# EAGLE board XMC4500_Relax-V1 (EAGLE 5.07)
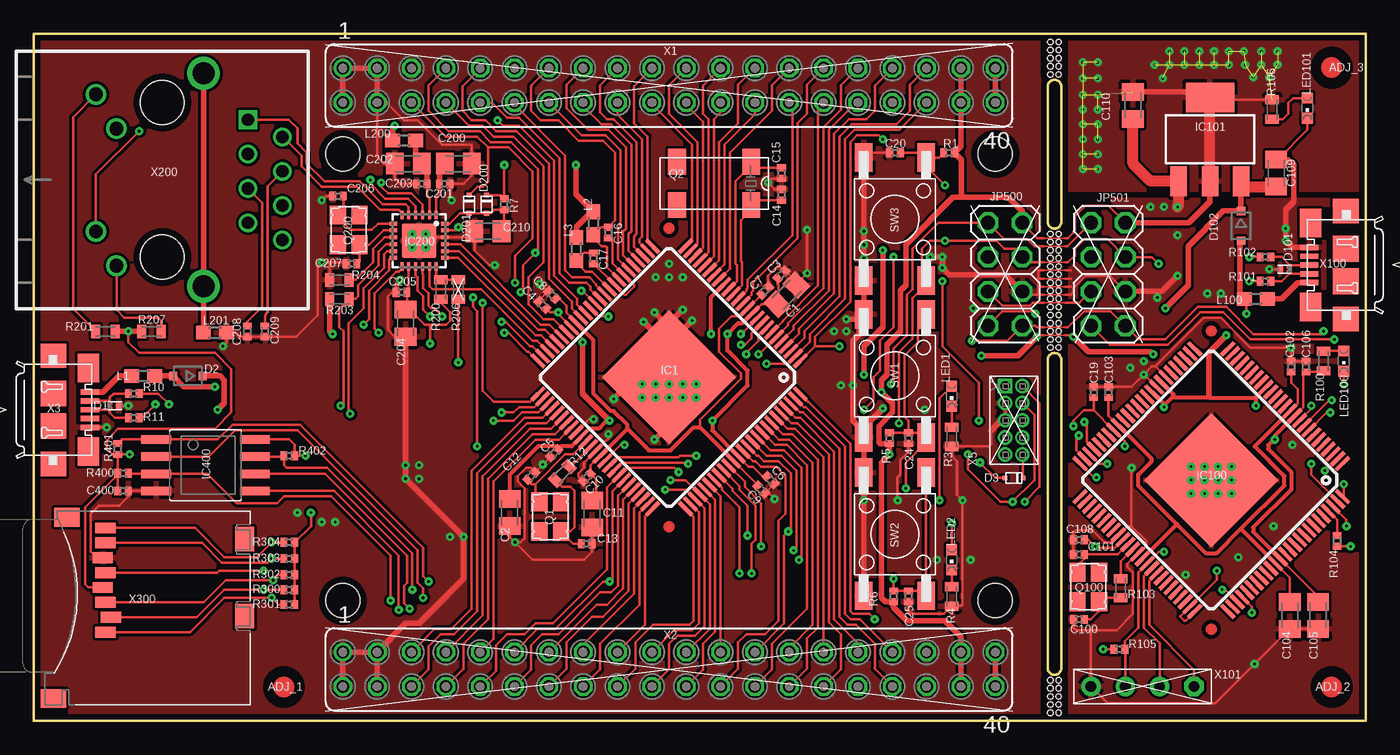
[diagram p2: board, top side]
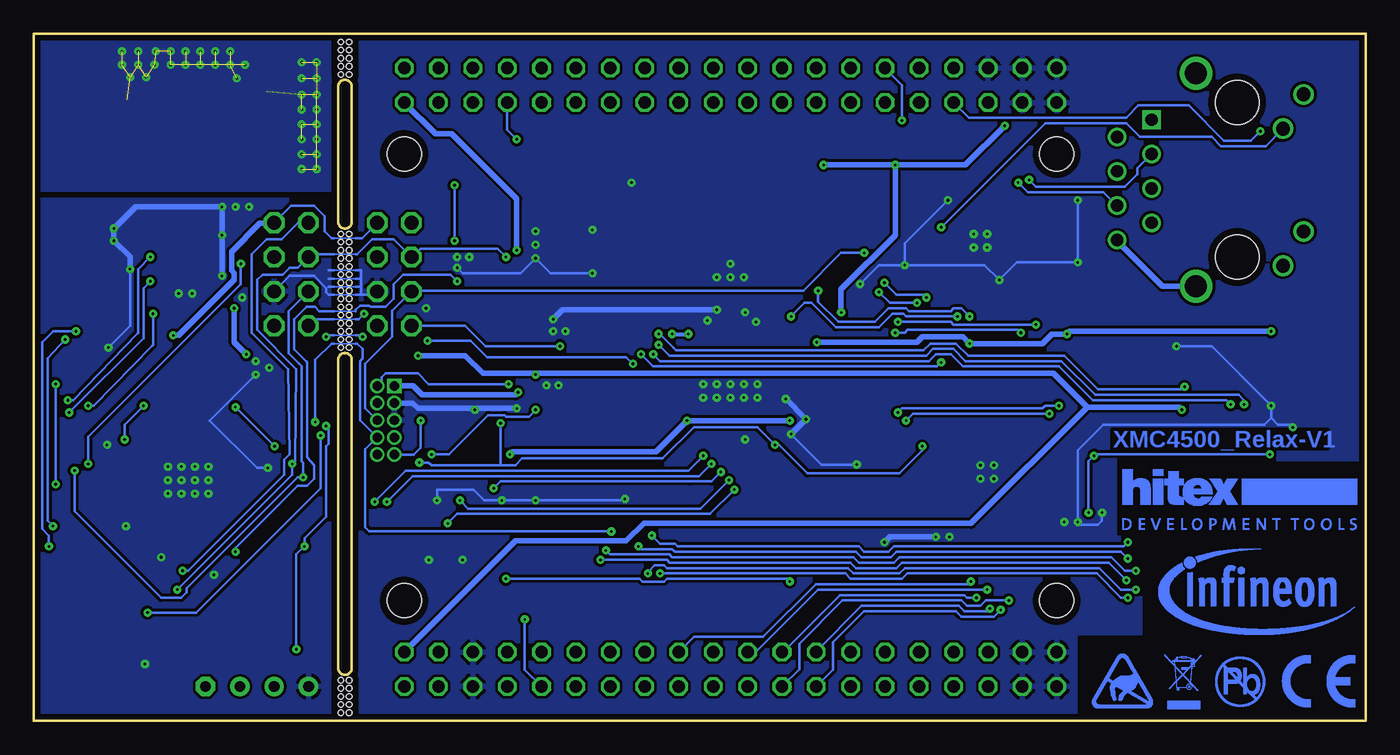
[diagram p3: board, bottom side, seen from below]

Size 98.52 x 50.8 mm. Coordinates in mm from the lower left corner, seen from the top.
Outline: 0,0 98.52,0 98.52,50.8 0,50.8 0,0
Outline: 75,46.9 arc-180 76,46.9 76,36.9 arc-180 75,36.9 75,46.9
Outline: 76,3.9 arc-180 75,3.9 75,26.7 arc-180 76,26.7 76,3.9
Copper layers (1*16): Top 0.035mm / dielectric 1.5mm / Bottom 0.035mm
Design rules "Hitzex_CPU_45A *": minimum track width 0.2mm, minimum drill 0.2mm, track to track 0.2mm, track to pad 0.2mm, pad to pad 0.2mm, via to via 0.2mm, smd to smd 0.2mm, copper to edge 0.5mm, drill to drill 0.5mm, minimum pad ring 7mil, minimum via ring 0.2mm, stop-mask expansion 4mil, vias tented up to drill 0.2mm, thermal gap 10mil
Holes 2.54 mm at 71.12,8.89 22.86,8.89 22.86,41.91 71.12,41.91
Holes 0.4 mm at 75.2,35.4 75.8,35.4 75.2,34.8 75.8,34.8 75.2,34.2 75.8,34.2 75.2,33.6 75.8,33.6 75.2,36 75.8,36 75.2,33 75.8,33 75.2,32.4 75.8,32.4 75.2,31.8 75.8,31.8 75.2,31.2 75.8,31.2 75.2,30.6 75.8,30.6 75.2,30 75.8,30 75.2,29.4 75.8,29.4 75.2,28.8 75.8,28.8 75.2,28.2 75.8,28.2 75.2,27.6 75.8,27.6 75.2,1.2 75.8,1.2 75.2,0.6 75.8,0.6 75.2,49.6 75.8,49.6 75.2,50.2 75.8,50.2 75.2,49 75.2,48.4 75.8,48.4 75.8,49 75.2,1.8 75.2,2.4 75.8,2.4 75.8,1.8 75.2,3 75.8,3 75.2,47.8 75.8,47.8
tRestrict: 4 lines
bRestrict: 6 lines
Milling: 12 lines

## Footprints (pad centres in the part's own frame; a part is rotated, then mirrored left to right if it is on the bottom)
C0805K = smd 1.3 x 1.6: 1 -1,0; 2 1,0
C0402 = smd 0.5 x 0.65: 1 -0.4,0; 2 0.4,0
TSLP-3-1 = smd 0.225 x 0.35: 1 0.113,-0.475; 2 0.487,-0.475 | smd 0.6 x 0.35: 3 0.3,0.175
SOD323-R = smd 0.6 x 0.6: A 1.1,0; C -1.1,0
SC79 = smd 0.35 x 0.35: 1 -0.675,0; 2 0.675,0
P/PG-LQFP-100-11 = smd 1.35 x 0.29: 1 -7.725,6; 2 -7.725,5.5; 3 -7.725,5; 4 -7.725,4.5; 5 -7.725,4; 6 -7.725,3.5; 7 -7.725,3; 8 -7.725,2.5; 9 -7.725,2; 10 -7.725,1.5; 11 -7.725,1; 12 -7.725,0.5; 13 -7.725,0; 14 -7.725,-0.5; 15 -7.725,-1; 16 -7.725,-1.5; 17 -7.725,-2; 18 -7.725,-2.5; 19 -7.725,-3; 20 -7.725,-3.5; 21 -7.725,-4; 22 -7.725,-4.5; 23 -7.725,-5; 24 -7.725,-5.5; 25 -7.725,-6; 51 7.725,-6; 52 7.725,-5.5; 53 7.725,-5; 54 7.725,-4.5; 55 7.725,-4; 56 7.725,-3.5; 57 7.725,-3; 58 7.725,-2.5; 59 7.725,-2; 60 7.725,-1.5; 61 7.725,-1; 62 7.725,-0.5; 63 7.725,0; 64 7.725,0.5; 65 7.725,1; 66 7.725,1.5; 67 7.725,2; 68 7.725,2.5; 69 7.725,3; 70 7.725,3.5; 71 7.725,4; 72 7.725,4.5; 73 7.725,5; 74 7.725,5.5; 75 7.725,6 | smd 0.29 x 1.35: 26 -6,-7.725; 27 -5.5,-7.725; 28 -5,-7.725; 29 -4.5,-7.725; 30 -4,-7.725; 31 -3.5,-7.725; 32 -3,-7.725; 33 -2.5,-7.725; 34 -2,-7.725; 35 -1.5,-7.725; 36 -1,-7.725; 37 -0.5,-7.725; 38 0,-7.725; 39 0.5,-7.725; 40 1,-7.725; 41 1.5,-7.725; 42 2,-7.725; 43 2.5,-7.725; 44 3,-7.725; 45 3.5,-7.725; 46 4,-7.725; 47 4.5,-7.725; 48 5,-7.725; 49 5.5,-7.725; 50 6,-7.725; 76 6,7.725; 77 5.5,7.725; 78 5,7.725; 79 4.5,7.725; 80 4,7.725; 81 3.5,7.725; 82 3,7.725; 83 2.5,7.725; 84 2,7.725; 85 1.5,7.725; 86 1,7.725; 87 0.5,7.725; 88 0,7.725; 89 -0.5,7.725; 90 -1,7.725; 91 -1.5,7.725; 92 -2,7.725; 93 -2.5,7.725; 94 -3,7.725; 95 -3.5,7.725; 96 -4,7.725; 97 -4.5,7.725; 98 -5,7.725; 99 -5.5,7.725; 100 -6,7.725 | smd 7 x 7: EXP 0,0
SOT223 = smd 1.219 x 2.235: 1 -2.311,-3.099; 2 0,-3.099; 3 2.311,-3.099 | smd 3.6 x 2.2: 4 0,3.099
QFN24 = smd 0.6 x 0.3: 1 -1.905,1.27; 2 -1.905,0.762; 3 -1.905,0.254; 4 -1.905,-0.254; 5 -1.905,-0.762; 6 -1.905,-1.27; 13 1.905,-1.27; 14 1.905,-0.762; 15 1.905,-0.254; 16 1.905,0.254; 17 1.905,0.762; 18 1.905,1.27 | smd 0.3 x 0.6: 7 -1.27,-1.905; 8 -0.762,-1.905; 9 -0.254,-1.905; 10 0.254,-1.905; 11 0.762,-1.905; 12 1.27,-1.905; 19 1.27,1.905; 20 0.762,1.905; 21 0.254,1.905; 22 -0.254,1.905; 23 -0.762,1.905; 24 -1.27,1.905 | smd 2.55 x 2.55: EXP 0,0
SO08W = smd 2.2 x 0.635: 1 -3.651,1.905; 2 -3.651,0.635; 3 -3.651,-0.635; 4 -3.651,-1.905; 5 3.651,-1.905; 6 3.651,-0.635; 7 3.651,0.635; 8 3.651,1.905
2X04 = drill 1.016 octagon: 1 -3.81,-1.27; 2 -3.81,1.27; 3 -1.27,-1.27; 4 -1.27,1.27; 5 1.27,-1.27; 6 1.27,1.27; 7 3.81,-1.27; 8 3.81,1.27
L1608 = smd 1.1 x 1: 1 -0.85,0; 2 0.85,0
CHIPLED_0603 = smd 0.8 x 0.8: A 0,-0.75; C 0,0.75
32X25_4PAD = smd 1.4 x 1.2: 1 -1.1,-0.8; 2 1.1,-0.8; 3 1.1,0.8; 4 -1.1,0.8
SMD4_270 = smd 1.3 x 1.9: 1 -2.75,-1.6; 2 2.75,-1.6; 3 2.75,1.6; 4 -2.75,1.6
R0402 = smd 0.5 x 0.65: 1 -0.4,0; 2 0.4,0
R0603 = smd 0.67 x 1: 1 -0.715,0; 2 0.715,0
FSM2JSMA = smd 2.1 x 1.3: P -4.55,-2.3; P1 4.55,-2.3; S -4.55,2.3; S1 4.55,2.3
FE20-2 = drill 0.914 round: 1 -24.13,1.27 | drill 0.914 octagon: 2 -24.13,-1.27; 3 -21.59,1.27; 4 -21.59,-1.27; 5 -19.05,1.27; 6 -19.05,-1.27; 7 -16.51,1.27; 8 -16.51,-1.27; 9 -13.97,1.27; 10 -13.97,-1.27; 11 -11.43,1.27; 12 -11.43,-1.27; 13 -8.89,1.27; 14 -8.89,-1.27; 15 -6.35,1.27; 16 -6.35,-1.27; 17 -3.81,1.27; 18 -3.81,-1.27; 19 -1.27,1.27; 20 -1.27,-1.27; 21 1.27,1.27; 22 1.27,-1.27; 23 3.81,1.27; 24 3.81,-1.27; 25 6.35,1.27; 26 6.35,-1.27; 27 8.89,1.27; 28 8.89,-1.27; 29 11.43,1.27; 30 11.43,-1.27; 31 13.97,1.27; 32 13.97,-1.27; 33 16.51,1.27; 34 16.51,-1.27; 35 19.05,1.27; 36 19.05,-1.27; 37 21.59,1.27; 38 21.59,-1.27; 39 24.13,1.27; 40 24.13,-1.27
ZX62-AB-5PA_MICRO-USB = smd 0.4 x 1.35: 1 -1.3,1.45; 2 -0.65,1.45; 3 0,1.45; 4 0.65,1.45; 5 1.3,1.45 | smd 2.1 x 1.6: S1 -3.1,1.35; S2 3.1,1.35 | smd 1.8 x 1.9: S3 -4,-1.25; S4 4,-1.25 | smd 1.9 x 1.9: S5 -1.2,-1.25; S6 1.2,-1.25
FTSH-105-01-F-D-K = drill 0.7 pad 1.05 square: 1 -2.54,-0.635 | drill 0.7 pad 1.05 round: 2 -2.54,0.635; 3 -1.27,-0.635; 4 -1.27,0.635; 5 0,-0.635; 6 0,0.635; 7 1.27,-0.635; 8 1.27,0.635; 9 2.54,-0.635; 10 2.54,0.635
MA04-1 = drill 0.8 pad 1.422 octagon: 1 -3.81,0 | drill 0.8 pad 1.422 round: 2 -1.27,0; 3 1.27,0; 4 3.81,0
J0-A/B/F = drill 0.914 square: 1 4.445,-6.35 | drill 0.914 round: 2 3.175,-8.89; 3 1.905,-6.35; 4 0.635,-8.89; 5 -0.635,-6.35; 6 -1.905,-8.89; 7 -3.175,-6.35; 8 -4.445,-8.89 | drill 1.016 round: 9 6.325,4.902; 10 3.785,3.378; 11 -3.81,4.902; 12 -6.35,3.378 | drill 1.626 round: S1 -7.874,-3.048; S2 7.874,-3.048 | hole 3.251: -5.715,0; 5.715,0
3M_MICRO-SD_SLOT = smd 0.8 x 1.5: 1 -1.94,2.7; 2 -0.84,2.3; 3 0.26,2.7; 4 1.36,2.9; 5 2.46,2.7; 6 3.56,2.9; 7 4.66,2.7; 8 5.76,2.7 | smd 1.4 x 1.9: S1 -6.85,6.55; S2 6.55,5.55 | smd 1.8 x 1.4: S3 4.95,-7.6; S4 -0.75,-7.6

## Placement (x,y rotation side)
ADJ_1  FIDUCIAL  [FIDUCIAL]  18.5,2.5 0 top
ADJ_2  FIDUCIAL  [FIDUCIAL]  96,2.5 0 top
ADJ_3  FIDUCIAL  [FIDUCIAL]  96,48.3 0 top
C1  10uF/10V  [C0805K]  55.7,31.52 45 top
C2  10uF/10V  [C0805K]  35.2,15.4 270 top
C3  100nF  [C0402]  55.3,33 45 top
C4  100nF  [C0402]  37.62,30.76 135 top
C5  100nF  [C0402]  38.5,19.8 225 top
C6  100nF  [C0402]  54.5,17.8 315 top
C7  100nF  [C0402]  54.1,31.8 45 top
C8  100nF  [C0402]  38.33,31.49 135 top
C9  100nF  [C0402]  53.8,17.1 315 top
C10  100nF  [C0402]  40.9,18 225 top
C11  10uF/10V  [C0805K]  41.3,15.3 270 top
C12  15pF  [C0402]  36.8,18.1 45 top
C13  15pF  [C0402]  40.9,13.1 0 top
C14  15pF  [C0402]  55.3,38.9 90 top
C15  15pF  [C0402]  55.3,40.5 270 top
C16  100nF  [C0402]  42.5,36.1 270 top
C17  100nF  [C0402]  41.4,34.2 270 top
C19  100nF  [C0402]  78.4,24.3 90 top
C20  10nF  [C0402]  63.7,42 180 top
C24  100nF  [C0402]  64.7,20.9 270 top
C25  100nF  [C0402]  64.7,9.2 270 top
C100  15pF  [C0402]  77.3,7.5 180 top
C101  15pF  [C0402]  77.3,12.3 180 top
C102  100nF  [C0402]  93,26.2 90 top
C103  100nF  [C0402]  79.5,24.3 90 top
C104  10uF/10V  [C0805K]  92.9,7.8 270 top
C105  10uF/10V  [C0805K]  95,7.8 270 top
C106  100nF  [C0402]  94.1,26.2 90 top
C108  100nF  [C0402]  77.3,13.4 180 top
C109  10uF/10V  [C0805K]  91.9,40.5 90 top
C110  10uF/10V  [C0805K]  81.3,45.5 270 top
C200  22uF/10V  [C0805K]  31.4,41.2 0 top
C201  100nF  [C0402]  30.4,39.7 0 top
C202  22uF/10V  [C0805K]  27.7,41.2 180 top
C203  100nF  [C0402]  28.7,39.7 180 top
C204  22uF/10V  [C0805K]  27.5,29.4 270 top
C205  100nF  [C0402]  27.2,31.7 180 top
C206  22pF  [C0402]  22.5,38.8 180 top
C207  22pF  [C0402]  23.5,33.8 180 top
C208  100nF  [C0402]  15.8,28.8 270 top
C209  100nF  [C0402]  17.1,28.8 270 top
C210  10uF/10V  [C0805K]  33.6,36.2 180 top
C400  100nF  [C0402]  6.6,17 0 top
D1  ESD8V0L2B-03L  [TSLP-3-1]  6.1,23.6 270 top
D2  BAT60A  [SOD323-R]  11.4,25.5 180 top
D3  BAT54-02V  [SC79]  72.5,17.96 180 top
D101  ESD8V0L2B-03L  [TSLP-3-1]  92.4,33.1 90 top
D102  BAT60A  [SOD323-R]  89.3,36.6 270 top
D200  BAT54-02V  [SC79]  33.5,38.2 270 top
D201  BAT54-02V  [SC79]  32.2,38.2 270 top
DRILEGEND  [DRILEGEND]  -15.14,-18.75 0 top  (outside the outline)
IC1  XMC4500_LQFP100  [P/PG-LQFP-100-11]  46.99,25.39 225 top
IC100  XMC4500_LQFP100  [P/PG-LQFP-100-11]  87.1,17.8 225 top
IC101  IFX1117MEV33  [SOT223]  87,43 0 top
IC200  KSZ8031RNL  [QFN24]  28.5,35.5 270 top
IC400  S25FL032P0XMFI01  [SO08W]  12.7,18.9 0 top
JP500  [2X04]  71.85,33.02 270 top
JP501  [2X04]  79.47,33.02 270 top
L1  BLM18PG600  [L1608]  8.1,25.5 180 top
L2  BLM18PG600  [L1608]  41.4,36.8 90 top
L3  BLM18PG600  [L1608]  40.13,34.89 90 top
L100  BLM18PG600  [L1608]  90.4,31.2 0 top
L200  BLM18PG600  [L1608]  27.4,42.9 0 top
L201  BLM18PG600  [L1608]  13.4,28.7 0 top
LED1  LED-RT/D/0603  [CHIPLED_0603]  67.9,24 180 top
LED2  LED-RT/D/0603  [CHIPLED_0603]  67.9,11.9 180 top
LED100  LED-GN/D/0603  [CHIPLED_0603]  96.9,26.6 180 top
LED101  LED-GN/D/0603  [CHIPLED_0603]  94.2,45.3 180 top
Q1  12MHZ/S/3.2X2.5  [32X25_4PAD]  38.2,15.1 270 top
Q2  32.768KHz  [SMD4_270]  50.33,39.74 180 top
Q100  12MHZ/S/3.2X2.5  [32X25_4PAD]  78,9.9 270 top
Q200  25MHz/50ppm  [32X25_4PAD]  23.3,36.3 270 top
R1  10k/0402  [R0402]  67.7,42 0 top
R3  680R  [R0603]  67.9,21 90 top
R4  680R  [R0603]  67.9,9.2 90 top
R5  10k  [R0402]  63.3,20.9 270 top
R6  10k  [R0402]  63.6,9.2 270 top
R7  10k  [R0402]  34.8,38.2 90 top
R10  33R  [R0402]  7.4,24.2 0 top
R11  33R  [R0402]  7.4,22.4 0 top
R12  510R  [R0603]  39.1,18.3 225 top
R100  680R  [R0603]  95.4,26.6 270 top
R101  33R/0402  [R0402]  91.1,32.5 0 top
R102  33R/0402  [R0402]  91.1,34.3 0 top
R103  510R/0603  [R0603]  80.4,9.8 270 top
R104  100R  [R0402]  96.4,13.3 270 top
R105  10k  [R0402]  80.3,5.3 180 top
R106  680R/0603  [R0603]  91.6,45.2 90 top
R200  1k  [R0603]  30.1,31.9 270 top
R201  120R  [R0603]  5.3,28.8 0 top
R203  1k  [R0603]  22.6,31.2 0 top
R204  6k49  [R0603]  22.6,32.6 0 top
R206  no ass./0R  [R0603]  31.4,31.9 270 top
R207  120R  [R0603]  8.7,28.8 180 top
R300  10k  [R0402]  18.9,9.7 0 top
R301  10k  [R0402]  18.9,8.6 0 top
R302  10k  [R0402]  18.9,10.8 0 top
R303  10k  [R0402]  18.9,12 0 top
R304  10k  [R0402]  18.9,13.2 0 top
R400  10k  [R0402]  6.6,18.3 180 top
R401  10k  [R0402]  6.2,20.1 270 top
R402  10k  [R0402]  18.9,19.6 0 top
SW1  TMPS2-SMD  [FSM2JSMA]  63.7,25.5 90 top
SW2  TMPS2-SMD  [FSM2JSMA]  63.7,13.8 90 top
SW3  TMPS2-SMD  [FSM2JSMA]  63.7,37.1 90 top
U$12  [INFINEON_ICON_3-SILK]  90.8,1.15 0 top
U$13  [INFINEON_LOGO_5-SILK]  21.59,17.78 0 top
U$71  [DIN_A5_L]  -50.8,-63.5 0 top  (outside the outline)
X1  2x20  [FE20-2]  46.99,46.99 0 top
X2  2*20  [FE20-2]  46.99,3.81 0 top
X3  ZX62-AB-5PA  [ZX62-AB-5PA_MICRO-USB]  2.7,23 270 top
X5  FTSH-105-01-F-D-K  [FTSH-105-01-F-D-K]  72.48,22.23 270 top
X100  ZX62-AB-5PA  [ZX62-AB-5PA_MICRO-USB]  95.8,33.7 90 top
X101  no ass.  [MA04-1]  82.01,2.54 180 top
X200  Würth 7499010211A  [J0-A/B/F]  9.5,40 90 top
X300  3M_2908-05WB  [3M_MICRO-SD_SLOT]  8,8.5 90 top

## Tracks (layer width: path | path; a pad name or v marks a point on that pad's centre or on a via)
AGND
  Top 0.2: C16.2 42.8,35.4 42.8,33.83 IC1.32 44.4,32.23 44.4,32.1 43.8,31.5 43.71,31.5 IC1.34 41.41,33.8 C17.2
CS  (via drill 0.2)
  Top 0.2: IC100.79 90.1,8.44 v90.1,8 | IC100.49 77.1,20.02 77.1,20.9 v77.3,21.1
  Bottom 0.2: v90.1,8 86.5,8 77.3,17.2 v77.3,21.1
DBGPRES#  (via drill 0.2)
  Top 0.2: X101.3 80.74,5.26 R105.1 80.7,5.9 81.7,6.9 81.7,10.99 IC100.65 83.21,12.5 v83.6,12.5 | v67.2,32.5 67.2,27.7 69.9,25 v69.9,22.2
  Bottom 0.102: 76.3,30.3 74.7,30.3
  Bottom 0.2: v83.6,12.5 83.6,12.8 79,17.4 78.3,17.4 77.8,17.9 77.8,18.9 78.3,19.5 78.3,26.5 78.39,26.6 79.27,27.48 79.27,29.68 78.35,30.6 77.7,30.6 77.4,30.3 76.3,30.3 | v67.2,32.5 67.7,33 71.2,33 71.9,32.3 71.9,31.2 72.5,30.6 73.6,30.6 73.7,30.7 74.4,30.7 74.7,30.4 74.7,30.3 | X5.9 70.42,19.68 69.9,20.2 v69.9,22.2
DEBUG_LED  (via drill 0.2)
  Top 0.2: IC100.100 96.9,16.68 v96.9,17.5 | v96.9,24.9 LED100.C
  Bottom 0.2: v96.9,17.5 v96.9,24.9
ETH_CLK  (via drill 0.2)
  Top 0.2: IC200.16 28.75,33.05 28.8,33 28.8,32 29.2,31.6 29.2,30.7 29.4,30.5 29.6,30.5 v30.2,29.9 | IC1.39 41.78,29.9 v42.5,29.9
  Bottom 0.2: v42.5,29.9 41.5,30.9 41,30.9 39.2,29.1 36,29.1 35,30.1 34.2,30.1 34,29.9 v30.2,29.9
ETH_CRS  (via drill 0.2)
  Top 0.2: IC200.15 28.25,32.95 28.4,32.8 28.4,31.8 28.8,31.4 28.8,30.4 v29.3,29.9 | IC1.38 40.59,31.8 v40.5,31.8
  Bottom 0.2: v40.5,31.8 40.5,31 39,29.5 36.3,29.5 35.3,30.5 34,30.5 33.8,30.3 30.7,30.3 30.5,30.5 29.9,30.5 v29.3,29.9
ETH_MDC  (via drill 0.2)
  Top 0.2: IC200.11 26.14,34.74 25.9,34.5 25.9,33.5 24.4,32 24.4,30.5 23.3,29.4 23.3,22.8 v23.4,22.7 | IC1.53 37.33,22.8 36.1,22.8 35.5,22.2 v34,22.2
  Bottom 0.2: v23.4,22.7 33.5,22.7 v34,22.2
ETH_MDIO  (via drill 0.2)
  Top 0.2: IC200.10 26.05,35.25 25.5,34.7 25.5,33.7 24,32.2 24,31.4 23.8,31.2 R203.2 22.6,30.48 22.6,29.1 22.9,28.8 22.9,23.5 v22.7,23.3 | IC1.52 37.02,23.2 35.9,23.2 35.5,22.8 v34.6,22.8
  Bottom 0.2: v22.7,23.3 23.7,23.3 23.9,23.1 34.3,23.1 v34.6,22.8
ETH_RXD0  (via drill 0.2)
  Top 0.2: IC1.50 36.6,27.3 36.5,27.3 35.1,28.7 v34.8,28.7 | IC200.13 27.23,33.43 27,33.2 26.8,33.2 25.2,31.6 25.2,29 v25.5,28.7
  Bottom 0.2: v25.5,28.7 25.7,28.9 33.9,28.9 34.1,28.7 v34.8,28.7
ETH_RXD1  (via drill 0.2)
  Top 0.2: IC1.49 36.91,27.7 36.7,27.7 34.9,29.5 v34.6,29.5 | IC200.12 26.43,34.23 26.3,34.1 26.3,33.3 24.8,31.8 24.8,29.7 v24.4,29.3
  Bottom 0.2: v24.4,29.3 30.5,29.3 30.7,29.5 v34.6,29.5
ETH_RXER
  Top 0.2: IC1.48 37.22,28.1 36.9,28.1 33.1,31.9 29.5,31.9 29.26,32.14 IC200.17
ETH_TXD0
  Top 0.2: IC1.46 37.83,28.9 37.3,28.9 31.46,34.74 IC200.20
ETH_TXD1
  Top 0.2: IC1.45 38.14,29.3 37.5,29.3 31.55,35.25 IC200.21
ETH_TXEN
  Top 0.2: IC1.47 37.52,28.5 37.1,28.5 31.37,34.23 IC200.19
GND  (via drill 0.2)
  Top 0.102: 74.7,31.5 76.3,31.5 | 74.7,32.1 76.3,32.1 | 74.7,32.7 76.3,32.7 | 74.7,33.3 76.3,33.3
  Top 0.2: v7,23.3 D1.3 | C105.2 C104.2 87.4,1.3 79.44,1.3 X101.4 78.2,6.7 | C106.2 C102.2 v93,27.6 90,27.6 87.8,29.8 86.54,29.8 82.94,26.2 | C19.2 C103.2 81.2,24.7 v82.1,25.6 | 78.2,6.7 80.1,6.7 81.3,7.9 81.3,11 80.9,11.4 80.9,11.6 IC100.63 82.3,13 82.3,13.3 81.2,14.4 | C100.2 76.9,6.9 77.1,6.7 78.2,6.7 | C101.2 C108.2 76.9,13.9 77.1,14.1 78.3,14.1 79.2,13.2 79.67,13.2 IC100.59 80.87,14.4 81.2,14.4 | v91.4,33.4 D101.3 | 56.41,32.46 C1.2 | 56.41,32.46 C3.2 55.52,33.28 55.1,33.7 54.3,32.9 54.3,32.17 C7.2 | C4.2 37.34,31.07 C8.2 37.52,32.3 v37.4,32.3 | C6.2 C9.2 54.38,16.82 v54.8,16.4 | C10.2 40.3,18.03 40.3,18.3 40.7,18.7 40.7,19.1 IC1.63 42.5,20.9 v42.5,21.2 | C5.2 v37.65,18.95 C12.2 36.77,18.7 36.4,18.7 35.8,18.1 35.8,17.7 36.3,17.2 36.3,13.5 36,13.2 v35.6,13.2 | C204.2 26.7,28.4 26.2,28.9 26.2,31.4 26.5,31.7 C205.2 26.8,32.3 v27.1,32.6 | C203.2 27.1,39.7 26.7,40.1 C202.2 25.9,41.2 25.4,41.7 X1.4 26.08,45.72 27.4,44.4 28.4,44.4 30.2,42.6 32.4,42.6 C200.2 32.4,40.3 31.8,39.7 C201.2 30.8,38.6 v30.9,38.5 | C25.2 64.7,8.1 64.9,7.9 67.31,7.9 R4.1 67.92,8.5 68.6,8.5 68.7,8.6 v68.7,16.3 68.3,16.7 68.3,19.2 67.9,19.6 R3.1 67.92,20.3 70.7,20.3 70.8,20.4 70.8,21.46 | C20.2 61.75,42 SW3.S1 | 41.2,14.3 C11.2 C13.2 41.3,12.5 40.7,11.9 36.9,11.9 v35.6,13.2 | C109.2 92,41.5 94.2,43.7 LED101.C | 82.94,26.2 IC100.32 | 82.94,26.2 82.7,26.2 v82.1,25.6 | IC100.34 82.13,25.6 v82.1,25.6 | v81.2,18.7 81.2,14.4 | C206.2 21.6,38.8 v21.3,38.5 | 21.89,33.9 23,33.9 C207.2 | 21.89,33.9 R204.1 | 21.89,33.9 v21.3,33.9 21,33.6 21,30 19.4,28.4 C209.2 C208.2 15.2,28.4 14.9,28.7 L201.2 14.25,27.95 v14,27.7
  Top 0.2: IC200.EXP 28.75,35.75 IC200.22 32.15,35.75 C210.2 32.6,34.8 33.7,33.7 v34.1,33.7 | 56.41,32.46 56.56,32.46 v57.2,33.1 v57.2,36.3 | C400.2 IC400.4 | C400.2 7,16.6 6.3,15.9 4.8,15.9 4.2,15.3 4.2,12.5 4.64,12.06 X300.6 | X3.5 v5.4,21.7 | C400.2 7,16.59 | C2.2 35.2,13.6 v35.6,13.2 | IC1.59 41.07,22.3 v41.4,22.3 | IC1.EXP 46.99,28.5 | 46.99,28.5 46.99,28.8 | 46.99,28.8 46.99,29.39 46.71,29.39 | 61.05,29.7 SW1.S1 | 46.99,28.8 45.8,28.8 | 46.99,28.5 47.6,28.5 | C24.2 64.7,19.9 64.1,19.3 64.1,18.2 63.9,18 v63.9,16.3 | C15.2 54.6,40.1 v54.3,39.8 54.8,39.3 C14.2 | 71.56,22.23 X5.5 X5.3 | JP500.6 73.37,31.5 74.3,31.5 | 74.3,31.5 74.7,31.5 | 76.3,31.5 76.7,31.5 76.9,31.7 76.9,32 77.8,32.9 79.59,32.9 JP501.6 | 74.3,32.1 74.7,32.1 | 74.3,31.5 74.3,32.1 | 74.3,32.7 74.7,32.7 | 74.3,32.1 74.3,32.7 | 74.7,33.3 74.3,33.3 74.3,32.7 | 76.3,32.1 76.7,32.1 | 76.3,32.7 76.7,32.7 | 76.3,33.3 76.7,33.3
  Top 0.4: X100.5 93.1,35 v92.6,35.5 v92.6,36.4 92.6,37.8 93.2,38.4 93.2,41.1 92.8,41.5 C109.2 | X2.2 X2.1 X2.3 | X2.3 X2.4 | X1.2 X1.1 X1.3 X1.4 | SW1.S1 SW3.S v61.4,34.2 SW3.S1 | SW2.S v61.4,16.3 SW2.S1 SW1.S | v84.6,32.9 83.45,31.75 JP501.6 | X2.3 27.52,7.2 28.5,7.2 31.8,10.5 v31.8,13.6 v27.5,17.9 C204.2 | 46.99,29.39 v48,30.4 | v60.1,29.7 61.05,29.7 61.05,28.55 60.6,28.1 60.6,22.2 61.05,21.75 61.05,21.3 SW1.S | 46.71,29.39 v45.9,30.2 | 45.8,28.8 v45.1,29.5 | 47.6,28.5 v48.7,29.6 | IC1.EXP 44.49,25.39 v42.9,23.8 | 70.8,21.46 71.56,22.23 | v62.8,23.1 61.4,21.7 SW1.S | JP500.6 71.87,33 67.7,33 v67.2,33.5 v67.2,34.3 v66.3,34.3 | v45.9,20.8 47.49,22.39
  Top 0.8: C110.2 81.3,41.2 82.6,39.9 IC101.1 84.69,38.09 v84.6,38
  Bottom 0.102: 74.7,31.5 76.3,31.5 | 74.7,32.1 76.3,32.1 | 74.7,32.7 76.3,32.7 | 74.7,33.3 76.3,33.3
  Bottom 0.2: v93,27.6 91.4,29.2 v91.4,33.4 | v82.1,25.6 85.5,22.2 82,18.7 v81.2,18.7 | v21.3,38.5 v21.3,33.9 25.8,33.9 v27.1,32.6 28.2,33.7 v34.1,33.7 | v34.1,33.7 36,33.7 v37.4,32.3 | v30.9,38.5 34.1,35.3 v34.1,33.7 | v57.2,33.1 60.3,33.1 v61.4,34.2 62.5,33.1 66.8,33.1 v67.2,33.5 | 7,22.4 v7,23.3 11.4,27.7 v14,27.7 | v37.65,18.95 40.25,18.95 v42.5,21.2 | v54.8,16.4 54.9,16.3 v61.4,16.3 v63.9,16.3 | v63.9,16.3 65.2,16.3 66,17.1 68.7,17.1 v68.7,16.3 | v63.9,16.3 64,16.4 | v19.5,15.4 19.5,14.8 19.8,14.5 21.1,14.5 v21.3,14.7 21.3,20 19.4,21.9 7.5,21.9 7,22.4 | 7,22.4 6.5,21.9 5.6,21.9 v5.4,21.7 | JP501.6 79.59,32.9 77.8,32.9 76.9,32 76.9,31.7 76.7,31.5 76.3,31.5 | JP500.6 73.37,31.5 74.3,31.5 | 74.3,31.5 74.7,31.5 | 74.3,31.5 74.3,32.1 | 74.3,32.1 74.3,32.7 | 74.3,32.7 74.3,33.3 74.7,33.3 | 74.3,32.1 74.7,32.1 | 74.3,32.7 74.7,32.7 | 76.3,33.3 76.7,33.3 | 76.3,32.7 76.7,32.7 | 76.3,32.1 76.7,32.1
  Bottom 0.4: v91.4,33.4 91.4,34.3 v92.6,35.5 v92.6,36.4 91,38 v84.6,38 v84.6,32.9 | v35.6,13.2 35.2,13.6 v31.8,13.6 | v42.5,21.2 v41.4,22.3 v42.9,23.8 | v48,30.4 59.4,30.4 v60.1,29.7 | X5.3 71.31,23.5 | v62.8,23.1 70.1,23.1 70.5,23.5 71.9,23.5
  other vias: 91.7,14.4 93.1,20.4 89.1,12.1 85.2,10.8 83.6,38 82.6,38 86.6,17.8 87.6,17.8 86.6,18.8 87.6,18.8 87.6,16.8 86.6,16.8 85.6,18.8 85.6,17.8 85.6,16.8 88.6,16.8 88.6,17.8 88.6,18.8 82.1,26.6 81.1,26.1 87.8,31.6 86.8,31.6 90.3,4.2 47,24.9 46,24.9 48,24.9 49,24.9 45,24.9 45,23.9 46,23.9 47,23.9 48,23.9 49,23.9 28,36 28,35 29,35 29,36 84.6,35.9 83.1,31.3 61.4,35.2 61.4,36.2 60.1,28.8 59.2,28.8 60.6,24.8 59.7,24.8 46,32.8 47,32.8 48,32.8 47,33.8 30.8,13.6 28.5,17.9 28.5,18.9 27.5,18.9 22.3,14.7 65.9,23 69.3,11.9 66.8,11.9 69.5,30.5
  pour Top: 76.5,38.5 98.7,38.5 98.7,-0.2 76.5,-0.2
  pour Bottom: 76.5,38.5 98.7,38.5 98.7,-0.2 76.5,-0.2
  pour Bottom: -0.2,51 -0.2,-0.2 74.5,-0.2 74.5,51
  pour Top: -0.2,51 -0.2,-0.2 74.5,-0.2 74.5,51
HIB_IO_0
  Top 0.2: 52.8,32.6 52.8,32.61 | X1.28 56.1,45.44 56.1,35.9 52.8,32.6 | IC1.14 52.7,31.8 52.7,31.9 52.8,32 52.8,32.6
HIB_IO_1
  Top 0.2: IC1.13 53.1,31.5 53.1,31.7 53.2,31.8 53.2,32.4 56.5,35.7 56.5,44.2 57.2,44.9 57.2,47.04 X1.29
MMC_CLK  (via drill 0.2)
  Top 0.2: X300.5 13.56,10.96 13.7,11.1 v17,11.1 | IC1.90 54.2,19.6 55.3,19.6 56.4,18.5 56.4,12.8 v56.2,12.6
  Bottom 0.2: v56.2,12.6 55.9,12.3 51.5,12.3 51.3,12.1 37.9,12.1 37.5,11.7 34.9,11.7 34.5,12.1 18.8,12.1 17.8,11.1 v17,11.1
MMC_CMD  (via drill 0.2)
  Top 0.2: X300.3 12.56,8.76 14.2,10.4 v17.7,10.4 18.1,10.8 R302.1 | IC1.91 54.51,20 55.5,20 56.8,18.7 56.8,12.1 v56.6,11.9
  Bottom 0.2: v17.7,10.4 19,11.7 34.3,11.7 34.7,11.3 37.7,11.3 38.1,11.7 51.5,11.7 51.7,11.9 v56.6,11.9
MMC_DAT0  (via drill 0.2)
  Top 0.2: X300.7 12.44,13.16 13.9,11.7 17.3,11.7 v17.6,12 R303.1 | IC1.85 52.6,17.66 52.6,17.3 53.8,16.1 v53.8,12.9
  Bottom 0.2: v53.8,12.9 53.6,12.7 51.3,12.7 51.1,12.5 37.7,12.5 37.3,12.1 35.1,12.1 34.7,12.5 18.1,12.5 v17.6,12
MMC_DAT1  (via drill 0.2)
  Top 0.2: X300.8 11.94,14.26 14.1,12.1 16.5,12.1 v17.6,13.2 R304.1 | IC1.83 51.7,17.15 51.7,17 52.8,15.9 v52.8,13.7
  Bottom 0.2: v52.8,13.7 52.2,13.1 51.1,13.1 50.9,12.9 37.5,12.9 37.1,12.5 35.3,12.5 34.9,12.9 17.9,12.9 v17.6,13.2
MMC_DAT2  (via drill 0.2)
  Top 0.2: X300.1 11.56,6.56 14.1,9.1 v17.6,9.1 18.1,8.6 R301.1 | IC1.82 50.9,17.24 50.9,17.1 51.9,16.1 52.2,15.8 v52.2,10.9
  Bottom 0.2: v17.6,9.1 18.1,9.1 19.9,10.9 33.9,10.9 34.3,10.5 38.1,10.5 38.5,10.9 v52.2,10.9
MMC_DAT3  (via drill 0.2)
  Top 0.2: X300.2 12.06,7.66 14.1,9.7 v17,9.7 R300.1 | v53.1,10.9 53.1,13.1 53.4,13.4 53.4,15.9 52.2,17.1 52.2,17.36 IC1.84
  Bottom 0.2: v17,9.7 18.1,9.7 19.7,11.3 34.1,11.3 34.5,10.9 37.9,10.9 38.3,11.3 51.7,11.3 51.9,11.5 52.6,11.5 53.1,11 v53.1,10.9
N$1
  Top 0.4: X100.1 93.5,32.4 92.3,31.2 L100.2
N$2
  Top 0.2: R207.1 9.41,29.59 9.2,29.8 6.7,29.8 6.12,30.38 X200.12
N$3
  Top 0.2: R100.1 95.44,27.35 LED100.A
N$4
  Top 0.2: R3.2 LED1.C
N$5
  Top 0.2: R4.2 LED2.C
N$6
  Top 0.2: IC1.62 39.7,18.8 R12.1
N$7
  Top 0.2: R12.2 39.09,17.3 39.7,17.3 40,17 40,14.3 39.7,14 Q1.3 | Q1.3 38.7,13.7 | C13.1 39.9,13.1 Q1.3
N$8
  Top 0.2: IC1.61 39.89,19.7 39.3,19.7 37.1,17.5 | C12.1 36.83,17.5 37.1,17.5 | Q1.1 37.1,16.4 37.1,17.5
N$11
  Top 0.4: X3.1 5.1,24.3 6.3,25.5 L1.2
N$13
  Top 0.2: X3.2 5.46,23.65 D1.1 5.62,23.93 5.9,24.2 R10.1
N$15
  Top 0.2: IC200.5 27.74,37.96 27.5,38.2 25.8,38.2 24.1,39.9 21.5,39.9 20.2,41.2 20.2,42 19.5,42.7 19.5,43.8 18.86,44.45 X200.1
N$16
  Top 0.2: R106.1 92.39,44.48 92.8,44.9 92.8,45.7 93.15,46.05 LED101.A
N$17
  Top 0.2: X200.9 2.9,44.63 2.9,30.48 R201.1
N$18  (via drill 0.2)
  Top 0.2: IC200.23 31.16,36.26 v31.4,36.5
  Bottom 0.2: v31.4,36.5 23.7,44.2 17.7,44.2 16.7,43.2 11.4,43.2 10.7,42.5 7.41,42.5 X200.10
N$19
  Top 0.2: L201.1
  Top 0.4: L201.1 X200.S1 X200.S2
  Bottom 0.4: X200.S1 15.03,32.13 18.39,35.49 X200.8
N$21
  Top 0.2: C210.1 34.8,36.2 R7.1 34.1,37.8 33.83,37.52 D200.2 D201.2 31.52,37.52 30.77,36.77 IC200.24
N$23  (via drill 0.2)
  Top 0.2: IC1.10 52.52,28.8 v52.3,28.6
  Top 0.4: L1.1 D2.A 11.1,24.7 v13.4,24.7
  Bottom 0.2: v13.4,24.7 13.6,24.5 19.8,24.5 22.3,27 29.4,27 30.3,27.9 32.2,27.9 32.7,27.4 51,27.4 51.2,27.6 52.2,28.6 v52.3,28.6
N$26
  Top 0.2: X5.10 73.17,19.63 D3.1
N$36
  Top 0.2: X3.3 5.51,23 D1.2 5.62,22.77 6,22.4 R11.1
N$40
  Top 0.2: X100.2 93.04,33.05 D101.1 92.88,33.08 92.3,32.5 R101.2
N$41
  Top 0.2: X100.3 92.99,33.7 D101.2 92.88,33.73 92.3,34.3 R102.2
N$43
  Top 0.2: C100.1 78.2,7.5 78.8,8.1 Q100.3 79.08,9.09 R103.2
N$47  (via drill 0.2)
  Top 0.2: IC100.10 94.5,23.08 v94.5,23.3 | v89.7,30.1 89.7,31.05 L100.1
  Top 0.4: D102.A 89.2,35.4 89.2,31.55 L100.1
  Bottom 0.2: v94.5,23.3 94.1,23.3 89.75,27.75 89.7,27.8 v89.7,30.1
N$50
  Top 0.2: IC200.6 27.23,37.57 27,37.8 25.6,37.8 23.9,39.5 21.3,39.5 19.8,41 19.8,41.77 X200.2
N$51  (via drill 0.2)
  Top 0.2: IC200.4 28.25,38.05 27.7,38.6 26,38.6 24.9,39.7 v24.9,40
  Bottom 0.2: v24.9,40 24.4,39.5 17.8,39.5 16.9,40.4 16.9,40.85 X200.3
N$52  (via drill 0.2)
  Top 0.2: IC200.3 28.75,38.15 27.9,39 26.2,39 25.7,39.5 v25.7,39.8
  Bottom 0.2: v25.7,39.8 25,39.1 19.39,39.1 X200.6
N$53
  Top 0.2: X200.4 17.3,39.55 17.3,30.2 17.1,30 C209.1
N$54
  Top 0.2: X200.5 16.9,38.31 16.9,30.6 15.8,29.5 C208.1
N$55
  Top 0.2: IC200.9 25.95,35.75 25.1,34.9 25.1,33.9 23.8,32.6 R204.2
N$58
  Top 0.2: IC200.8 25.86,36.26 24.8,35.2 Q200.3 24.1,34 C207.1
N$59
  Top 0.2: IC200.7 25.47,36.77 25,36.3 23.4,36.3 22.5,37.2 Q200.1 22.9,37.8 C206.1
N$69
  Top 0.2: IC200.2 29.26,38.64 29.1,38.8 C203.1 | 29.1,40.8 C202.1
  Top 0.4: C203.1 29.1,40.8 | L200.2 28.25,41.65 C202.1
N$70
  Top 0.2: 30,40.8 C200.1 | IC200.1 29.77,38.67 30,38.9 C201.1
  Top 0.4: C201.1 30,40.8
P0.0  (via drill 0.2)
  Top 0.102: 74.7,29.1 76.3,29.1
  Top 0.2: X1.36 64.02,43.7 60.7,43.7 60,43 60,31.2 57.4,28.6 57.4,28.02 IC1.2 55.78,26.4 v54.2,26.4 | v97.4,12.9 R104.2 | v95.4,28.8 95.2,28.6 90.2,28.6 88.2,30.6 86.1,30.6 83.7,28.2 81.75,28.2 JP501.8 79.65,30.3 77.7,30.3 76.5,29.1 76.3,29.1 | JP500.8 72.01,28.1 v69.4,28.1 | JP500.8 73.31,29.21 | 74.7,29.1 74.2,29.1 74.09,29.21 JP500.8
  Bottom 0.2: v97.4,12.9 97.4,13.7 97.9,14.2 97.9,28 97.1,28.8 v95.4,28.8 | v54.2,26.4 54.7,26.9 65,26.9 66.2,28.1 v69.4,28.1
P0.1  (via drill 0.2)
  Top 0.2: IC1.1 57.8,27.71 | v62.8,43 62.5,43.3 60.9,43.3 60.4,42.8 60.4,31 57.8,28.4 57.8,27.71 | IC100.98 97.1,14.87 v97.1,14.4 | v96.2,28.2 90,28.2 88,30.2 86.3,30.2 83.9,27.8 79.61,27.8 JP501.7 | v59.6,27.7 59.59,27.71 57.8,27.71 | JP500.7 71.65,30.28 73.92,30.28 v74.1,30.1
  Bottom 0.102: 74.7,29.7 76.3,29.7
  Bottom 0.2: X1.34 63.5,43.7 v62.8,43 | v96.2,28.2 97.5,26.8 97.5,14.8 v97.1,14.4 | v59.6,27.7 65.1,27.7 66.61,29.21 JP500.7 | JP501.7 77.71,29.7 76.3,29.7 | 74.7,29.7 74.5,29.7 v74.1,30.1
P0.2  (via drill 0.2)
  Top 0.2: v62.2,7.5 61.8,7.9 60.6,7.9 60.4,8.1 60.4,20.5 57.3,23.6 57.27,23.6 IC1.100
  Bottom 0.2: v62.2,7.5 62.2,3.78 X2.32
P0.3
  Top 0.2: X2.33 62.1,6.5 61.1,7.5 60.4,7.5 60,7.9 60,20.3 57.1,23.2 56.96,23.2 IC1.99
P0.4
  Top 0.2: X2.34 62.2,3.84 62.2,5.7 60.8,7.1 60.2,7.1 59.6,7.7 59.6,20.1 56.9,22.8 56.66,22.8 IC1.98
P0.5
  Top 0.2: X2.31 60.96,5.74 59.2,7.5 59.2,19.9 56.7,22.4 56.35,22.4 IC1.97
P0.6
  Top 0.2: X2.30 59.7,3.82 59.7,6.4 58.8,7.3 58.8,19.7 56.5,22 56.04,22 IC1.96
P0.7  (via drill 0.2)
  Top 0.2: IC1.89 53.49,19.6 53.6,19.6 54,19.2 55.1,19.2 56,18.3 56,14.2 v55.8,14 55.5,13.7 55.5,7.2 53.38,5.08 X2.25 | IC100.47 77.9,20.64 77.9,21.9 v77.7,22.1
  Bottom 0.102: 74.7,27.9 76.3,27.9
  Bottom 0.2: v55.8,14 73.7,14 74,14.3 74,20.07 X5.8 74.4,22.23 74.4,26.6 74.2,26.8 74.2,27.5 74.6,27.9 74.7,27.9 | v77.7,22.1 77.7,26.7 76.5,27.9 76.3,27.9
P0.8
  Top 0.2: IC1.88 53.19,19.2 53.4,19.2 53.8,18.8 54.9,18.8 55.6,18.1 55.6,15.3 55.1,14.8 55.1,7.4 54.1,6.4 52.7,6.4 52.1,5.8 52.1,3.84 X2.24
P0.9
  Top 0.2: IC1.4 56.6,28.64 56.6,29 59.2,31.6 59.2,43.4 60.3,44.5 61.6,44.5 62.2,45.1 62.2,46.96 X1.33
P0.10
  Top 0.2: IC1.3 57,28.33 57,28.8 59.6,31.4 59.6,43.2 60.5,44.1 63.8,44.1 64.8,45.1 64.8,47.02 X1.35
P0.11
  Top 0.2: IC1.95 55.73,21.6 56.3,21.6 58.4,19.5 58.4,5.1 X2.29
P0.12
  Top 0.2: X2.28 57.2,3.86 57.2,6.1 58,6.9 58,19.3 56.1,21.2 55.43,21.2 IC1.94
P1.0  (via drill 0.2)
  Top 0.2: X2.21 50,6.82 50,16.02 IC1.79 48.22,17.8 v47.1,17.8 | v67,16.3 67,23.85 LED1.A
  Bottom 0.2: v47.1,17.8 49.2,15.7 66.4,15.7 v67,16.3
P1.1  (via drill 0.2)
  Top 0.2: X2.20 47,3.82 47,5.7 47.6,6.3 48.9,6.3 49.6,7 49.6,15.71 IC1.78 48.22,17.1 v46.7,17.1 | v67.9,14.6 LED2.A
  Bottom 0.2: v67.9,14.6 67.2,15.3 48.5,15.3 v46.7,17.1
P1.2  (via drill 0.2)
  Top 0.2: IC1.77 49.2,15.41 49.2,7.2 48.7,6.7 47.34,6.7 X2.19 | IC400.7 18.43,19.54 R402.1 18.5,18.9 18.7,18.7 21.7,18.7 28,12.4 v28,9.7
  Bottom 0.2: X2.19 45.12,5.08 40.5,9.7 v28,9.7
P1.3  (via drill 0.2)
  Top 0.2: IC1.76 48.8,15.1 48.8,7.4 48.5,7.1 45.8,7.1 44.5,5.8 44.5,3.86 X2.18 | R400.1 7.04,18.27 IC400.3 12.84,18.27 15,16.1 18,16.1 18.5,16.6 22,16.6 26.4,12.2 v26.4,8.9
  Bottom 0.2: X2.18 41.9,3.82 41.9,5.7 38.7,8.9 29.9,8.9 29.5,8.5 28.5,8.5 28.1,8.9 v26.4,8.9
P1.4  (via drill 0.2)
  Top 0.2: IC1.75 45.2,15.12 45.2,7.1 X2.17 | IC400.2 12.94,19.54 14.9,21.5 19.5,21.5 28.4,12.6 28.4,10.2 28.8,9.8 v28.8,9.1
  Bottom 0.2: X2.17 43.12,5.08 38.9,9.3 29.7,9.3 29.5,9.1 v28.8,9.1
P1.5  (via drill 0.2)
  Top 0.2: IC1.74 44.8,15.42 44.8,8.6 41.9,5.7 41.9,3.8 X2.16 | v27,8.2 27,12.2 22.2,17 IC400.5
  Bottom 0.2: X2.16 39.4,3.78 39.4,5.8 37.1,8.1 30.3,8.1 29.9,7.7 27.5,7.7 v27,8.2
P1.8  (via drill 0.2)
  Top 0.2: IC1.81 50,17.4 50.8,16.6 X2.23 | R401.1 6.5,20.8 IC400.1 13.61,20.8 14.7,21.9 19.7,21.9 28.8,12.8 28.8,10.7 v29.2,10.3
  Bottom 0.2: X2.23 49.68,6.2 44.6,6.2 40.68,10.1 29.4,10.1 v29.2,10.3
P1.9
  Top 0.2: IC1.80 50.4,16.33 50.4,6.6 49.5,5.7 49.5,3.78 X2.22
P1.10  (via drill 0.2)
  Top 0.2: IC1.73 44.4,15.73 44.4,9.4 40.64,5.64 X2.15 | IC400.6 21.54,18.27 27.6,12.2 27.6,10.2 27.4,10 27.4,8.7 v27.8,8.3
  Bottom 0.2: X2.15 40.64,5.16 37.3,8.5 30.1,8.5 29.7,8.1 28,8.1 v27.8,8.3
P1.11
  Top 0.2: IC1.72 44,16.04 44,9.6 42.1,7.7 41.3,7.7 39.4,5.8 39.4,3.84 X2.14
P1.12
  Top 0.2: IC1.71 43.6,16.34 43.6,9.8 42.4,8.6 41.62,8.6 X2.13
P1.13
  Top 0.2: IC1.70 43.2,16.65 43.2,10 42.7,9.5 41.9,9.5 38.8,6.4 37.6,6.4 36.8,5.6 36.8,3.78 X2.12
P1.14  (via drill 0.2)
  Top 0.2: IC1.69 42.8,16.96 42.8,10.5 v42.6,10.3 42.1,10.3 38.6,6.8 37.28,6.8 X2.11 | 65.65,9.6 SW2.P | 65.65,9.6 C25.1 R6.1 v63.6,10.5 | SW2.P1 66,9.95 65.65,9.6
  Bottom 0.2: v42.6,10.3 42.8,10.5 51.7,10.5 51.9,10.3 53.5,10.3 53.7,10.5 v63.6,10.5
P1.15  (via drill 0.2)
  Top 0.2: X2.10 34.2,3.72 34.2,5.6 35,6.4 36.3,6.4 37.1,7.2 38.4,7.2 42.4,11.2 42.4,17.27 IC1.68 43.84,18.7 47.4,18.7 v47.7,18.4 | C24.1 R5.1 | C24.1 65.65,21.3 SW1.P 66,20.6 64.5,19.1 v64.5,17.2 | C24.1 64.7,22.2 64.4,22.5 64.4,27 65.4,28 65.4,28.9 66,29.5 SW1.P1
  Bottom 0.2: v47.7,18.4 48.4,17.7 50,17.7 64,17.7 v64.5,17.2
P2.1  (via drill 0.2)
  Top 0.102: 74.7,30.9 76.3,30.9
  Top 0.2: JP500.5 71.65,30.68 73.68,30.68 73.9,30.9 74.7,30.9 | 76.3,30.9 77.35,30.9 JP501.5 | X1.7 29.2,46.98 29.2,45.1 30.7,43.6 33,43.6 33.8,42.8 35.3,42.8 37.3,40.8 37.3,34.8 v37.1,34.6 36.2,33.7 36.2,31.9 v36,31.7 | IC100.2 95.58,18.5 v95.5,18.5 | IC100.50 78.42,18 v78.6,18 | v33.2,30.9 33.2,24.4 34,23.6 36.72,23.6 IC1.51
  Bottom 0.2: v95.5,18.5 95.5,15.5 89.1,9.1 87.6,9.1 87.2,9.5 87.2,9.8 79,18 v78.6,18 78.6,19.1 78.7,19.2 78.7,26.2 78.88,26.4 79.67,27.19 79.67,30.28 JP501.5 | v36,31.7 35.2,30.9 v33.2,30.9 | v37.1,34.6 38.8,34.6 41.6,31.8 70.53,31.8 JP500.5 72,30.33 72,28.4 74,26.4 74,23.11 X5.6
P2.6
  Top 0.2: IC1.54 37.64,22.4 36.3,22.4 32.4,18.5 32.4,8.3 30.9,6.8 29.66,6.8 X2.5
P2.10  (via drill 0.2)
  Top 0.2: IC1.44 38.44,29.7 37.7,29.7 36.6,30.8 36.6,32.8 37.7,33.9 37.7,41 35.5,43.2 34,43.2 33.2,44 32.2,44 X1.8 | v7.8,43.6 4.6,40.4 X200.11
  Bottom 0.2: X1.8 29.36,44.6 17.7,44.6 16.8,45.5 13.1,45.5 10.5,42.9 8.5,42.9 v7.8,43.6
P2.14
  Top 0.2: IC1.41 39.8,30.46 39.8,31 38.1,32.7 38.1,41.2 35.7,43.6 34.2,43.6 33.4,44.4 32.4,44.4 31.7,45.1 31.7,46.94 X1.9
P2.15  (via drill 0.2)
  Top 0.2: IC1.40 40.2,30.77 40.2,31.2 38.5,32.9 38.5,41.4 35.9,44 34.7,44 v34.3,44.4
  Bottom 0.2: X1.11 34.3,47 v34.3,44.4
P3.0
  Top 0.2: X1.30 58,45.3 58,32.2 55.4,29.6 55.4,29.56 IC1.7
P3.1  (via drill 0.2)
  Top 0.2: X1.31 59.7,47 59.7,45.2 58.4,43.9 58.4,32 55.8,29.4 55.8,29.25 IC1.6 53.65,27.1 v53.6,27.1 | v31.4,26.5 R206.2
  Bottom 0.2: v31.4,26.5 31.7,26.2 52.7,26.2 v53.6,27.1
P3.1_S
  Top 0.2: IC200.18 29.77,32.95 R200.1 R206.1
P3.2
  Top 0.2: IC1.5 56.2,28.94 56.2,29.2 58.8,31.8 58.8,43.7 60.82,45.72 X1.32
P3.3
  Top 0.2: X2.27 55.88,5.38 57.6,7.1 57.6,19.1 55.9,20.8 55.12,20.8 IC1.93
P3.4
  Top 0.2: X2.26 54.6,3.8 54.6,5.7 57.2,8.3 57.2,18.9 55.7,20.4 54.81,20.4 IC1.92
P5.0
  Top 0.2: IC1.58 38.86,20.8 37.1,20.8 34,17.7 34,6.06 X2.9
P5.1
  Top 0.2: IC1.57 38.56,21.2 36.9,21.2 33.6,17.9 33.6,7.5 31.8,5.7 31.8,3.86 X2.8
P5.2
  Top 0.2: IC1.56 38.25,21.6 36.7,21.6 33.2,18.1 33.2,7.8 X2.7
P5.7
  Top 0.2: IC1.55 37.94,22 36.5,22 32.8,18.3 32.8,8.1 31.1,6.4 30.1,6.4 29.2,5.5 29.2,3.8 X2.6
P14.0
  Top 0.2: IC1.31 43.2,34.13 43.2,36.4 43.4,36.6 43.4,42.2 42.3,43.3 40.52,43.3 X1.14
P14.1
  Top 0.2: IC1.30 43.6,34.44 43.6,36.2 43.8,36.4 43.8,42.4 42.5,43.7 41,43.7 39.4,45.3 39.4,47.02 X1.15
P14.2
  Top 0.2: IC1.29 44,34.75 44,36 44.2,36.2 44.2,42.6 42.7,44.1 42,44.1 40.64,45.46 X1.16
P14.3
  Top 0.2: IC1.28 44.4,35.06 44.4,35.8 44.6,36 44.6,42.8 42.9,44.5 42.4,44.5 41.9,45 41.9,46.98 X1.17
P14.4
  Top 0.2: IC1.27 44.8,35.36 44.8,35.6 45,35.8 45,43 43.18,44.82 X1.18
P14.5
  Top 0.2: IC1.26 45.4,35.47 45.4,43.2 44.4,44.2 44.4,46.94 X1.19
P14.6
  Top 0.2: IC1.25 48.7,35.59 48.7,42.6 45.72,45.58 X1.20
P14.7
  Top 0.2: X1.21 47,47 47,44.9 49.1,42.8 49.1,35.28 IC1.24
P14.8
  Top 0.2: IC1.37 41.2,31.89 41.2,32.1 40.9,32.4 39.6,32.4 38.9,33.1 38.9,41.6 35.9,44.6 35,44.6 33.88,45.72 X1.10
P14.9
  Top 0.2: IC1.36 41.6,32.2 41.6,32.3 41.1,32.8 39.8,32.8 39.3,33.3 39.3,41.8 35.56,45.54 X1.12
P14.12
  Top 0.2: IC1.23 49.5,34.97 49.5,44.3 48.26,45.54 X1.22
P14.13
  Top 0.2: IC1.22 49.9,34.66 49.9,44.5 49.5,44.9 49.5,46.96 X1.23
P14.14
  Top 0.2: IC1.21 50.3,34.36 50.3,44.5 50.8,45 X1.24
P14.15
  Top 0.2: IC1.20 50.7,34.05 50.7,42.8 52.1,44.2 52.1,47.02 X1.25
P15.2
  Top 0.2: IC1.19 51.1,33.74 51.1,42.6 53.34,44.84 X1.26
P15.3
  Top 0.2: IC1.18 51.5,33.44 51.5,42 54.6,45.1 54.6,46.98 X1.27
RESET#  (via drill 0.2)
  Top 0.102: 74.7,33.9 76.3,33.9
  Top 0.2: X1.6 30.46,43.2 32.8,43.2 33.6,42.4 | 33.6,42.4 35.1,42.4 36.9,40.6 36.9,35.7 35.6,34.4 v35.6,32.4 | D201.1 32.83,39.5 33.23,39.5 33.6,39.88 33.6,42.4 | C20.1 65.65,42 SW3.P1 | IC100.99 94.5,18.18 v94.5,19 | v83.2,33.8 82.71,34.29 JP501.4 79.43,35.6 77.7,35.6 77,34.9 77,34.4 76.5,33.9 76.3,33.9 | v32.5,31.3 32.5,30.6 32.8,30.3 v32.8,20.3 | IC1.65 43.41,20.4 v43.7,20.4 | R1.1 66.95,41.65 SW3.P1 | v67.4,39.6 66,41 SW3.P1 | v64,22 64,27.25 65,28.25 65,31.25 66,32.25 SW3.P 65.7,32.85 65.7,34.9 66.3,35.5 v67.4,35.5 71.2,35.5 71.8,34.9 72.53,34.9 JP500.4 73.51,33.9 74.7,33.9 | D3.2 71.14,17.96 v70,19.1
  Bottom 0.2: v94.5,19 94.5,21 83.2,32.3 v83.2,33.8 | v35.6,32.4 34.7,31.5 32.7,31.5 v32.5,31.3 | v32.8,20.3 32.8,20 34.5,18.3 41.3,18.3 43.4,20.4 v43.7,20.4 45,21.7 49.7,21.7 52,19.4 62.4,19.4 62.9,18.9 64,18.9 | v67.4,35.5 v67.4,39.6 | 64,18.9 69.1,18.9 69.3,19.1 v70,19.1 | 64,18.9 v64,22
RTC1
  Top 0.2: IC1.15 52.4,32.21 52.4,33.9 52.3,34 52.3,37 52.6,37.3 52.6,37.66 Q2.4 53.44,38.5 C14.1
RTC2
  Top 0.2: IC1.16 52,32.52 52,33.7 51.9,33.8 51.9,39.9 53.08,41.08 Q2.1 53.52,40.9 C15.1
TCK  (via drill 0.2)
  Top 0.2: IC100.78 88.13,9.7 v87.9,9.7 | IC100.48 78.83,19 v79.4,19 | IC1.67 43.53,19.1 48.3,19.1 v48.4,19 | v63.6,34.3 63.6,29.1 62.6,28.1 62.6,25.9 62.1,25.4 62.1,23.7 v61.4,23 | X5.4 74,22.61 74,17.8 v72.4,16.2 71.5,16.2 69.1,18.6 v69.1,19.7
  Bottom 0.102: 74.7,34.5 76.3,34.5
  Bottom 0.2: 74.7,34.5 74.6,34.5 73.5,35.6 71.89,35.6 JP500.3 70.51,34.29 69.9,34.9 64.2,34.9 v63.6,34.3 | 76.3,34.5 77.99,34.5 JP501.3 78.99,33.5 79.6,33.5 80.1,33 81.6,33 82,32.6 82,28.9 79.1,26 79.2,19.2 v79.4,19 79.4,18.2 v87.9,9.7 | v48.4,19 49.3,18.1 70.5,18.1 v72.4,16.2 | v61.4,23 61.9,22.5 63.6,22.5 63.7,22.6 64.9,22.6 67.8,19.7 v69.1,19.7
TMS  (via drill 0.2)
  Top 0.102: 74.7,35.1 76.3,35.1
  Top 0.2: 74.7,35.1 74,35.1 73.5,35.6 71.81,35.6 JP500.1 66.93,36.83 65,34.9 65,31.9 64.6,31.5 64.6,28.5 63.6,27.5 63.6,25.1 v63.4,24.9 | IC100.75 85.2,7.4 85.1,7.4 84.8,7.7 84.8,7.72 IC100.74 87.5,10.42 v87.5,11.1 | IC1.66 43.22,19.5 47.7,19.5 47.8,19.6 v49,19.6 | X5.2 74.4,23.48 74.4,17.3 v73.3,16.2 | 76.3,35.1 76.47,35.1 JP501.1
  Bottom 0.2: v87.5,11.1 87.1,11.1 80,18.2 80,19.3 79.6,19.7 79.7,26 82.4,28.7 82.4,34.5 81.3,35.6 80.2,35.6 78.97,36.83 JP501.1 | v49,19.6 50.1,18.5 71,18.5 v73.3,16.2 | v63.4,24.9 69.3,24.9 70.1,25.7 72.5,25.7 72.8,25.4 72.8,25.09 X5.2
TXD
  Top 0.2: IC100.97 96.4,14.86 R104.1
USB_DM  (via drill 0.2)
  Top 0.2: R10.2 9.2,24.2 v10,23.4 | IC1.8 54.19,29.09 53.6,28.5 53.6,28.1 52.7,27.2 v52.7,27.1
  Bottom 0.2: v10,23.4 10.3,23.7 20.2,23.7 22.7,26.2 29.8,26.2 30.7,27.1 31.8,27.1 32.3,26.6 52.2,26.6 v52.7,27.1
USB_DP  (via drill 0.2)
  Top 0.2: R11.2 8,22.4 v9,23.4 | IC1.9 53.1,28.67 53.1,28.3 52.6,27.8 v52.3,27.8
  Bottom 0.2: v9,23.4 9,23.7 9.4,24.1 20,24.1 22.5,26.6 29.6,26.6 30.5,27.5 32,27.5 32.5,27 51.5,27 v52.3,27.8
VAREF
  Top 0.2: X1.13 36.8,46.96 36.8,45.1 37.5,44.4 38.8,44.4 40.3,42.9 42.1,42.9 43,42 43,37 C16.1 41.95,36.5 L2.1 41.4,35.7 42,35.1 42.3,35.1 42.4,35 42.4,33.52 IC1.33
VDD3.3  (via drill 0.2)  (36 unrouted)
  Top 0.102: 74.7,35.7 76.3,35.7
  Top 0.2: IC100.87 95,9.19 C105.1 | 78.4,22.96 C19.1 | 78.4,22.96 IC100.43 80.7,20.66 v80.7,20.3 | IC100.11 93.9,23.19 93.9,25.6 C106.1 95.31,25.8 R100.2 | C108.1 78,13.4 v78.5,12.9 78.6,12.8 79.98,12.8 IC100.60 | C3.1 55.1,32.63 55,32.53 55,32.3 55.1,32.2 55.1,31.39 54.99,31.39 C1.1 53.81,30.8 IC1.11 | L2.2 41.25,37.65 | 38.8,30.05 IC1.43 40.6,28.25 v40.6,28 | IC200.14 27.74,31.84 C205.1 27.6,30.8 C204.1 27.8,30.4 28.9,29.3 29.4,29.3 | D200.1 34.52,38.88 R7.2 v34.8,41.1 | v79.1,5.3 R105.2 | 83.7,23.4 83.62,23.4 | 90.37,23.9 IC100.17 | 84.4,23.9 84.3,24 | R106.2 87.18,45.91 IC101.4 | 78.4,22.96 77.66,22.96 76.9,22.2 v76.9,21.8 | 83.62,23.22 v83.6,23.2 | R200.2 30.1,30.9 30.8,30.2 30.8,29.6 30.5,29.3 29.4,29.3 | v29.3,27.9 29.3,29.2 29.4,29.3 | C4.1 38.18,30.2 v38.8,30.2 | X300.4 4.04,9.86 3.8,10.1 3.8,15.8 6.2,18.2 R400.2 | R400.2 R401.2 | R301.2 R300.2 R302.2 R303.2 R304.2 20.5,14.4 v20.5,15.4 | IC1.87 52.88,18.8 53.2,18.8 53.92,18.08 C6.1 | R400.2 C400.1 | IC400.8 18.89,20.8 19.3,20.4 R402.2 v20.1,19.6 | R401.2 v7.1,19.7 | R401.2 5.8,19.7 5.4,20.1 5.4,20.7 6.2,21.6 13.4,21.6 14.6,22.8 14.6,26 13.4,27.2 7.8,27.2 7,28 v7,28.8 | JP500.2 74.25,35.7 74.7,35.7 | 76.3,35.7 76.5,35.7 77,36.2 77,37.3 77.8,38.1 79.5,38.1 80.74,36.86 JP501.2
  Top 0.3: C2.1 35.2,18.2 37.3,20.3 38.57,20.3 C5.1 39,20.3 39.78,20.3 IC1.60 41.08,21.6 41.8,21.6 42.3,22.1 42.4,22.1 42.5,22.2 v42.6,22.2 | IC1.11 52.41,29.4 52.1,29.4 v51.3,28.6 51.3,27.4 52.8,25.9 52.8,24.8 v50.2,22.2 50.2,21.48 IC1.87 | IC100.35 83.62,23.4 83.62,23.22 | IC100.33 84.3,24.14 84.3,24 83.7,23.4 | 86.9,23.9 84.4,23.9 | 86.9,24 86.9,23.9 | 86.9,23.9 90.37,23.9 | IC100.87 90.2,13.99 90.2,14.3 93,17.1 93,18.4 91.3,20.1 91.3,20.39 91.8,20.89 v91.8,20.8 91.8,21.09 IC100.11 | IC100.17 90.4,23.93 v90.4,23.3 | 38.8,30.05 v38.8,30.2 | IC1.17 50.1,31.33 v50.1,28.6
  Top 0.4: X1.37 X1.38 68.58,42.48 R1.2 68.6,41.5 68.6,38.7 | L3.2 40.13,36.53 41.25,37.65 | X2.38 X2.37 68.58,6.22 67.4,7.4 64.6,7.4 63.6,8.4 R6.2 63,8.8 62.7,9.1 62.7,19.1 v63.3,19.7 R5.2 62.6,20.5 62.5,20.6 62.5,21.8 63.5,22.8 63.5,23.5 v62.7,24.3 62.7,25.2 63.1,25.6 63.1,27.8 64.1,28.8 64.1,31.8 64.5,32.2 64.5,35.2 68,38.7 68.6,38.7 | C110.1 86.6,46.5 IC101.4 | IC101.2 87,38.4 85.43,36.83 JP501.2 | L200.1 26.55,43.85 v26.7,44 | L2.2 40.1,38.95 v40.1,41.1 | v22.1,28.6 21.89,28.82 R203.1 | R201.2 v7,28.8 R207.2 | v42.6,22.2 40.6,24.2 v40.6,28 | JP500.2 73.12,37.68 72.1,38.7 68.6,38.7 | v88.2,28.5 86.9,27.2 86.9,24
  Top 0.8: IC101.2 IC101.4
  Bottom 0.102: 74.7,35.7 76.3,35.7
  Bottom 0.2: v79.1,5.3 79.1,12.3 v78.5,12.9 78.5,13.5 76.9,15.1 76.9,20.3 76.7,20.5 76.7,21.6 v76.9,21.8 | v90.4,23.3 91.8,21.9 v91.8,20.8 | v83.6,23.2 v80.7,20.3 | v7.1,19.7 20,19.7 v20.1,19.6 20.5,19.2 v20.5,15.4 | JP500.2 74.25,35.7 74.7,35.7 | 76.3,35.7 76.5,35.7 77,36.2 77,37.3 77.8,38.1 79.5,38.1 80.8,36.8
  Bottom 0.3: v51.3,28.6 v50.1,28.6
  Bottom 0.4: v26.7,44 29.6,41.1 v34.8,41.1 | v34.8,41.1 v40.1,41.1 | v7,28.8 21.9,28.8 v22.1,28.6 23.2,28.6 23.9,27.9 v29.3,27.9 29.8,28.4 32.8,28.4 33.2,28 v40.6,28 | v63.3,19.7 63.1,19.9 52.5,19.9 v50.2,22.2 v42.6,22.2 | v34.8,41.1 34.8,35.9 38.8,31.9 v38.8,30.2 | 80.8,36.8 81.8,36.8 83.9,34.7 83.9,33.3 83.7,33.1 83.7,32.6 87.8,28.5 v88.2,28.5 | v62.7,24.3 62.9,24.1 69.8,24.1 70.47,24.77 X5.1
  other vias: 84,48.5 85.1,48.5 86.2,48.5 87.3,48.5 88.4,48.5 89.6,48.5 82.9,48.5 90.8,48.5 92,48.5 90.2,47.6 91.4,47.6 83.5,47.5 85.1,49.5 86.2,49.5 87.3,49.5 88.4,49.5 89.5,49.5 90.8,49.5 84,49.5 92,49.5 77.6,41.9 77.6,43 77.6,44.1 77.6,45.2 77.6,46.3 77.6,47.5 77.6,40.8 77.6,48.7 78.7,41.9 78.7,43 78.7,44.1 78.7,45.2 78.7,46.3 78.7,47.5 78.7,40.8 78.7,48.7
  pour Bottom: 76.5,51 98.7,51 98.7,39.3 76.5,39.3
  pour Top: 76.5,51 98.7,51 98.7,39.3 76.5,39.3
VDD5  (via drill 0.2)
  Top 0.102: 74.7,28.5 76.3,28.5
  Top 0.2: v74.2,28.4 74.3,28.5 74.7,28.5 | v76.9,28.4 76.8,28.5 76.3,28.5
  Top 0.4: X1.40 X1.39 | X2.39 X2.40 | 89.71,39.5 IC101.3 D102.C 88,37.7 85.4,35.1 85.4,32.2 v83.7,30.5 | D2.C 13.8,25.5 14.1,25.2 14.1,23.5 v13.6,23 | v62.8,34.8 62.8,29.1 61.4,27.7 v61.4,25.6 | v70.1,27 72.8,27 v74.2,28.4 | v76.9,28.4 78,27.3 82.6,27.3 v82.8,27.1
  Top 0.8: 89.71,39.5 C109.1
  Bottom 0.102: 74.7,28.5 76.3,28.5
  Bottom 0.2: v74.2,28.4 74.3,28.5 74.7,28.5 | 76.3,28.5 76.8,28.5 v76.9,28.4
  Bottom 0.4: v13.6,23 13.8,23.2 20.6,23.2 | 20.6,23.2 23.1,25.7 61.5,25.7 | 61.5,25.7 65.3,25.7 66.6,27 v70.1,27 | X2.39 62.9,13.3 54.7,13.3 53.4,14.6 29.2,14.6 20.6,23.2 | X1.40 68.8,43.4 67.6,43.4 62.8,38.6 v62.8,34.8 | 61.5,25.7 v61.4,25.6 | v82.8,27.1 83.7,28 v83.7,30.5
VDDA
  Top 0.2: C17.1 40.69,34.6 L3.1 40.13,33.87 40.8,33.2 41.31,33.2 IC1.35
VDDC
  Top 0.2: C7.1 IC1.12 52.31,30 52.2,30 52.1,29.9 51.6,29.9 50.7,29 50.7,27.3 52.3,25.7 52.3,25.3 49.27,22.27 49.27,21.7 | IC1.42 39.4,30.16 39.4,30.7 38.9,31.2 C8.1 | IC1.64 41.2,18.89 41.2,18.3 C10.1 41.6,17.87 41.6,16.7 C11.1 | IC1.86 53.52,17.45 C9.1
  Top 0.3: IC1.64 43.91,21.6 | 43.91,21.6 43.9,21.6 45.5,20 47.1,20 48.8,21.7 49.27,21.7 IC1.86 | IC1.42 41.4,28.16 41.4,24.2 42.7,22.9 42.9,22.9 43.91,21.89 43.91,21.6
WTCK
  Top 0.2: X101.1 85.82,3.78 82.5,7.1 82.5,10.37 IC100.67
WTMS
  Top 0.2: IC100.66 82.1,10.68 82.1,6.9 83.28,5.72 X101.2
WUSB_DM  (via drill 0.2)
  Top 0.2: IC100.8 95.64,22.8 v95.9,22.8 | v89.9,32.5 R101.1
  Bottom 0.2: v95.9,22.8 90.4,28.3 90.4,32 v89.9,32.5
WUSB_DP  (via drill 0.2)
  Top 0.2: IC100.9 95.83,23.7 v96,23.7 | v89.9,34.3 R102.1
  Bottom 0.2: v96,23.7 95.6,23.7 90.84,28.64 90.8,28.69 90.8,33.4 v89.9,34.3
WVDDC
  Top 0.2: IC100.86 92.9,10.59 C104.1 | C103.1 79.5,22.57 IC100.42 | IC100.12 93.5,23.49 93.5,24.5 93,25 C102.1
  Top 0.3: 89.3,14.19 IC100.86 | 89.3,14.19 89.3,14.2 87.5,12.4 86.7,12.4 84.55,14.55 | 84.55,14.55 81.7,17.4 81.7,18.2 82.7,19.2 82.7,19.37 IC100.42 | IC100.64 84.55,14.54 84.55,14.55 | 89.3,14.19 92.5,17.39 92.5,18.1 90.3,20.3 90.3,20.29 IC100.12
WXTAL1
  Top 0.2: IC100.61 80.19,12.3 C101.1 77.7,12 77.2,11.5 Q100.1
WXTAL2
  Top 0.2: IC100.62 80.4,11.81 R103.1
(copper drawn outside any net)
  shapes: Bottom area x10706

## Text on the board
Top: Layer 1 TOP
Bottom: Layer 2 BOT | XMC4500_Relax-V1
tPlace: Assembly | Alle C's ohne Wertangabe = 100n | BPL
Document: R1 / 19.08.2012 / Ma | 1/1
Reference: Mechanical drawing | 50x 0.4mm | drills, NPTH | 9.2 mm | 50.8 mm | 47.4 mm | 36.4 mm | 27.2 mm | 3.4 mm | 75.5 mm | 98.52 mm | MPL
LITE: (LITE)
tSilk: TOP Silkscreen | 1 | X1 | 2 | 10 | 20 | 30 | Power | IC101 | 1 | 1 | Q2 | RESET | IC200 | X100 | Debug | X3 | LED2 | IC100 | X200 | IC1 | P1.0 | IC400 | BUTTON2 | Q1 | X5 | LED1 | XMC4500 Relax/Relax Lite Kit-V1 | P1.1 | BUTTON1 | www.infineon.com/xmc-dev | 9 | 19 | 29 | Q100 | X300 | 1 | X2 | 2 | 1
bSilk: BOT Silkscreen | GND | VDD5 | VAREF | P14.13 | P14.15 | GND | P2.1 | P2.14 | P2.15 | P14.1 | P14.3 | P14.5 | P14.7 | P15.3 | HIB_1 | P3.1 | P0.9 | P0.10 | VDD3.3 | X1 | P14.12 | P14.14 | RST# | P2.10 | P14.8 | P14.9 | P14.0 | P14.2 | P14.4 | P14.6 | P15.2 | HIB_0 | P3.0 | P3.2 | P0.1 | P0.0 | P1.14 | P1.12 | P1.10 | P0.11 | P2.6 | P5.2 | P5.0 | P1.4 | P1.2 | P1.0 | P1.8 | P0.7 | P3.3 | P0.5 | P0.3 | VDD3.3 | GND | X2 | P1.15 | P1.13 | P1.11 | P0.12 | P5.7 | P5.1 | P1.5 | P1.3 | P1.1 | P1.9 | P0.8 | P3.4 | P0.6 | P0.2 | P0.4 | VDD5 | GND
DrillLegend: Drill legend | DPL